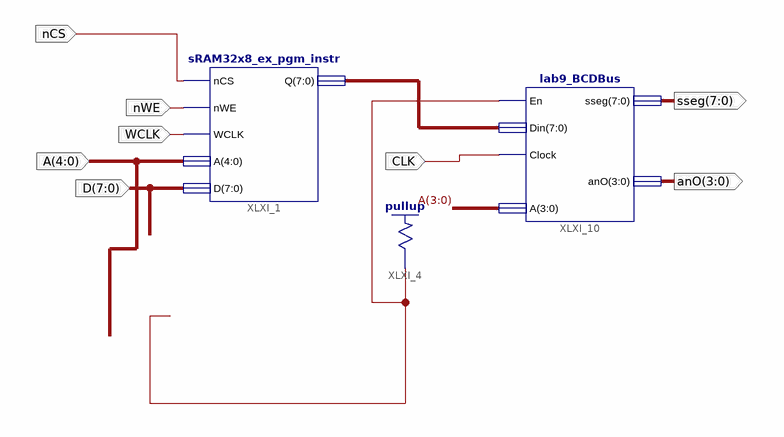
[diagram p0: schematic sheet 1]
// Xilinx ISE schematic test_Memory.sch (spartan3e) as structural Verilog: 3 symbols, 8 ports
module test_Memory (
  input  [7:0] D,
  input  nCS,
  input  nWE,
  input  WCLK,
  input  [4:0] A,
  input  CLK,
  output [7:0] sseg,
  output [3:0] anO
);

  wire XLXN_30;
  wire [7:0] XLXN_1;

  sRAM32x8_ex_pgm_instr XLXI_1 (.nCS(nCS), .nWE(nWE), .WCLK(WCLK), .A(A), .D(D), .Q(XLXN_1));
  \pullup  XLXI_4 (.O(XLXN_30));
  lab9_BCDBus XLXI_10 (.En(XLXN_30), .Din(XLXN_1), .Clock(CLK), .sseg(sseg), .anO(anO), .A(A[3:0]));
endmodule
